# EAGLE board PowerBoard (EAGLE 6.4)
REVISION: C; TITLE: Yellowstone
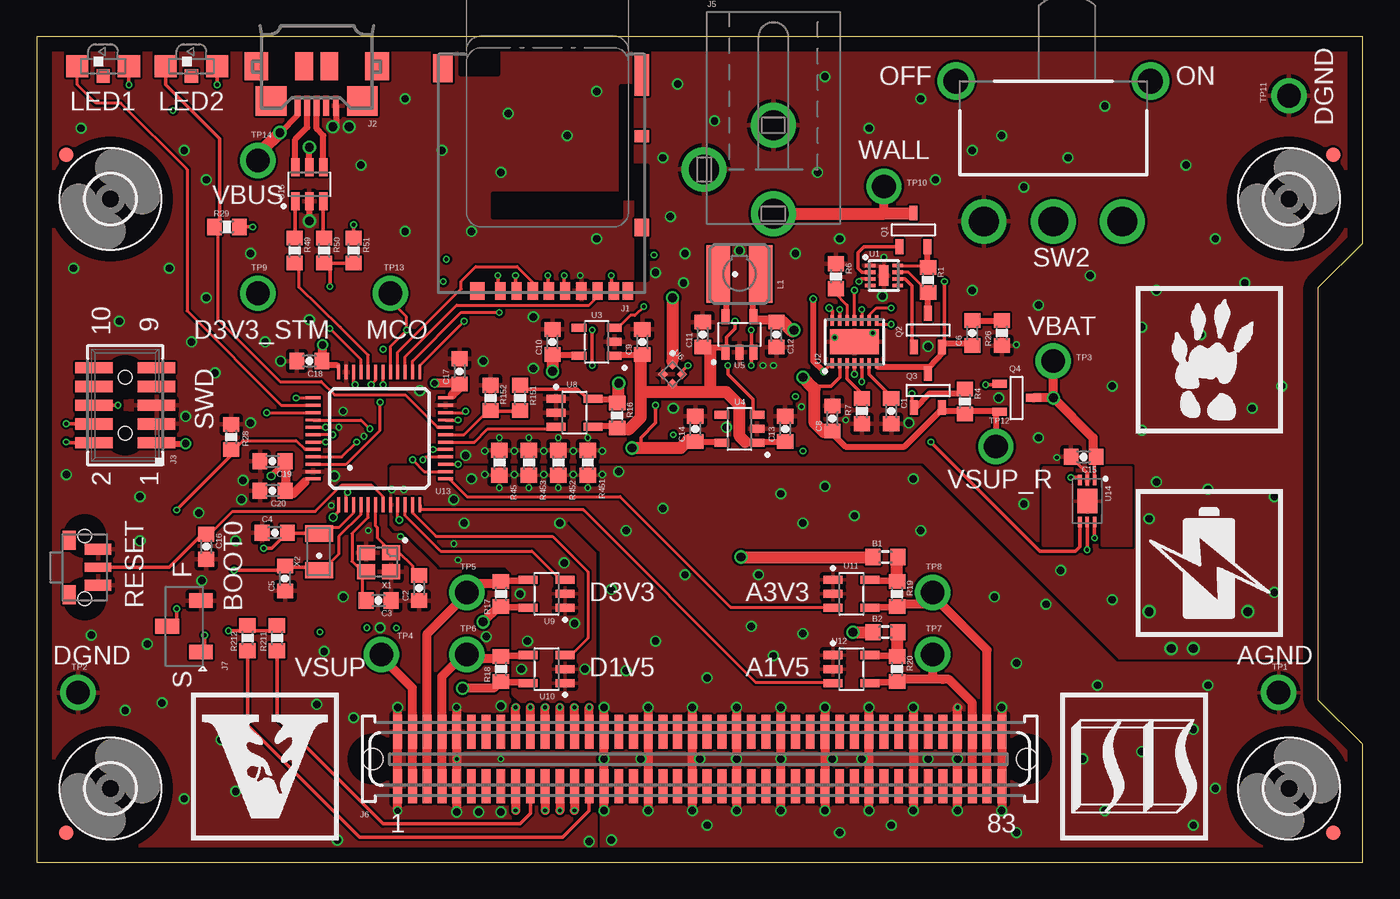
[diagram p5: board, top side]
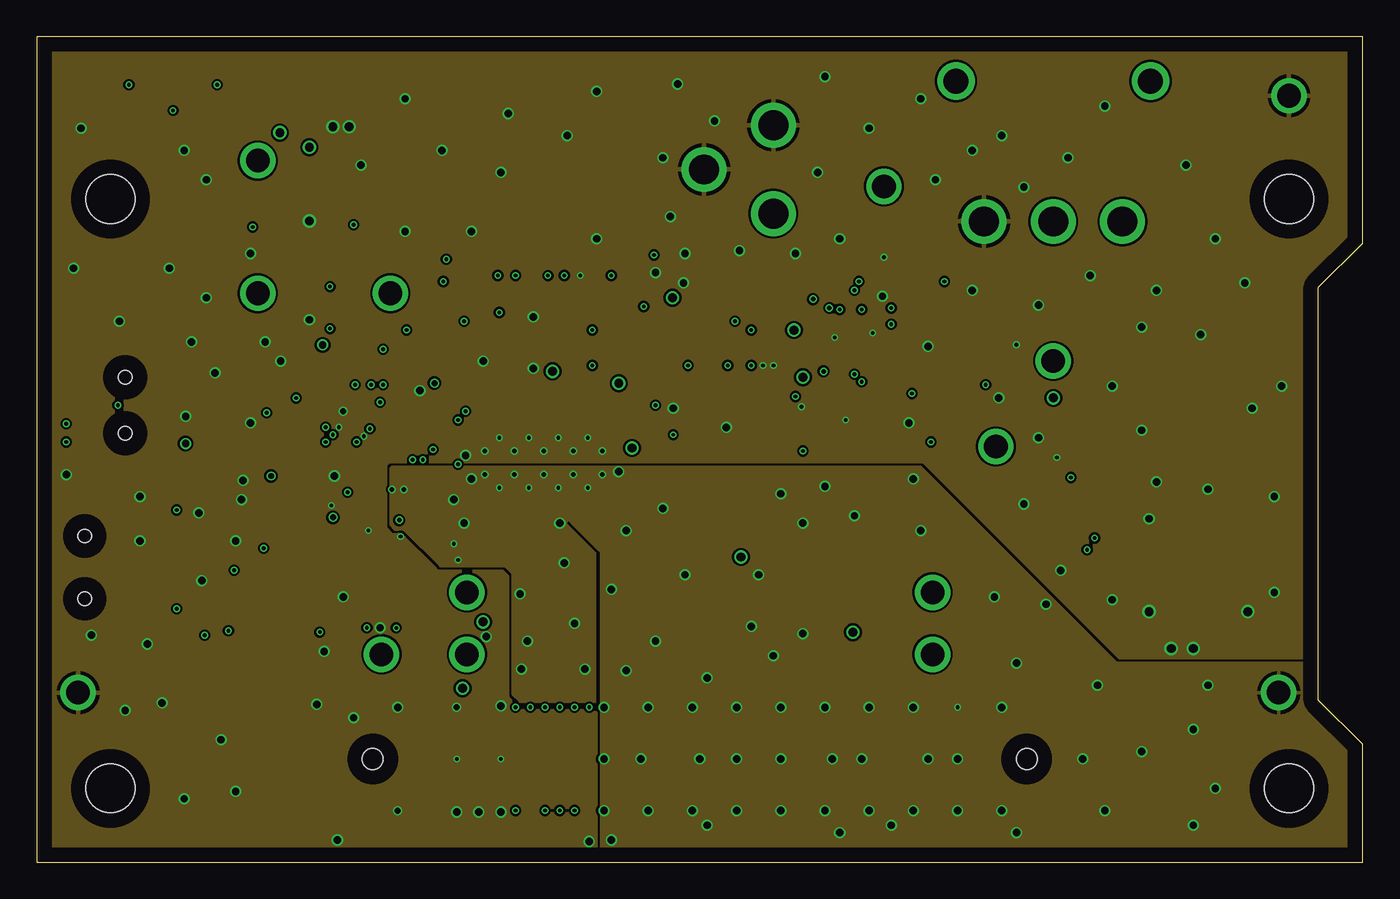
[diagram p6: board, inner layer GND]
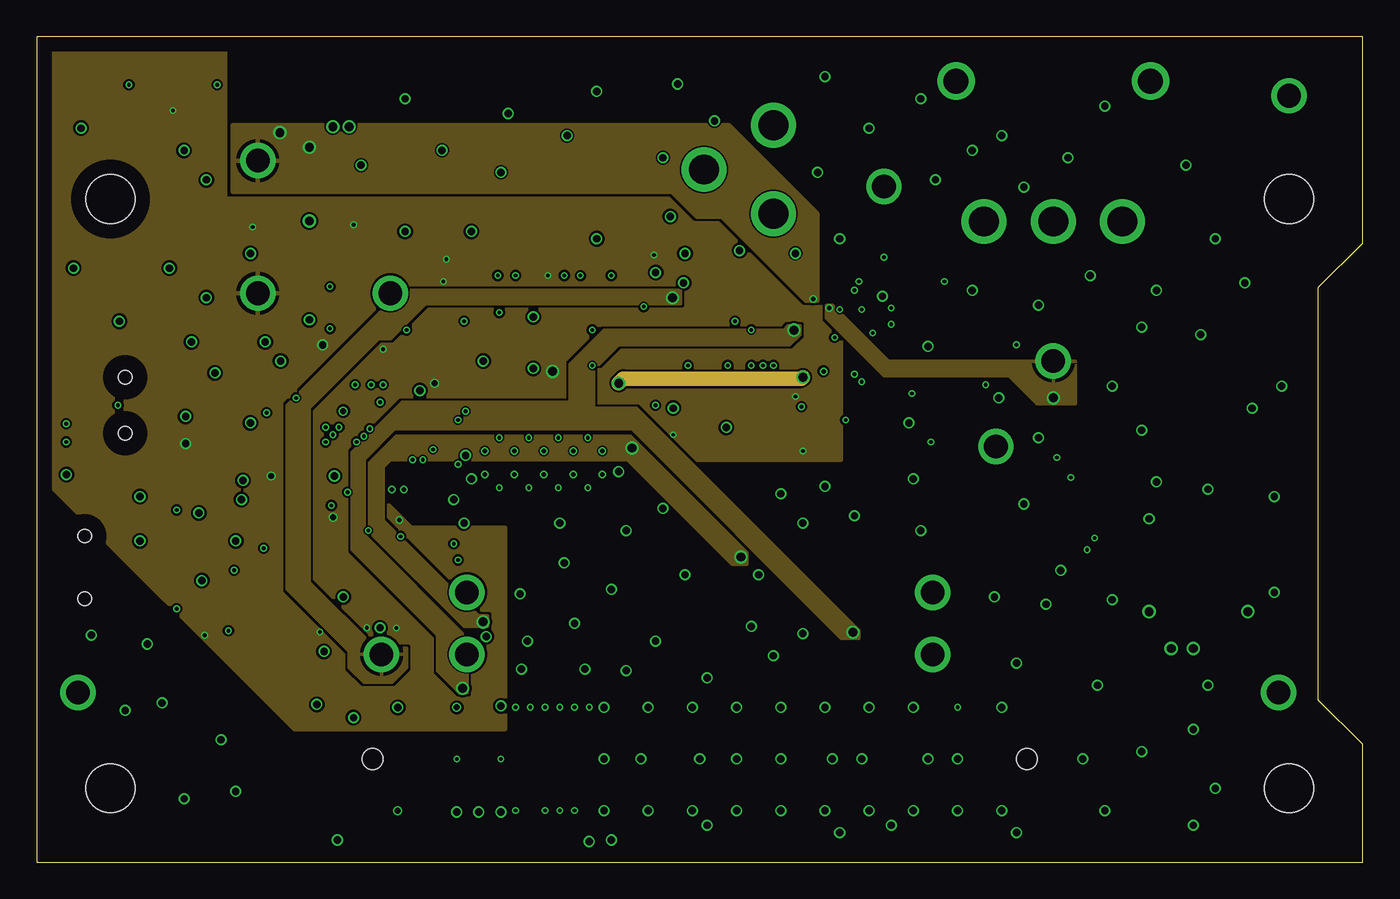
[diagram p7: board, inner layer SUPPLY]
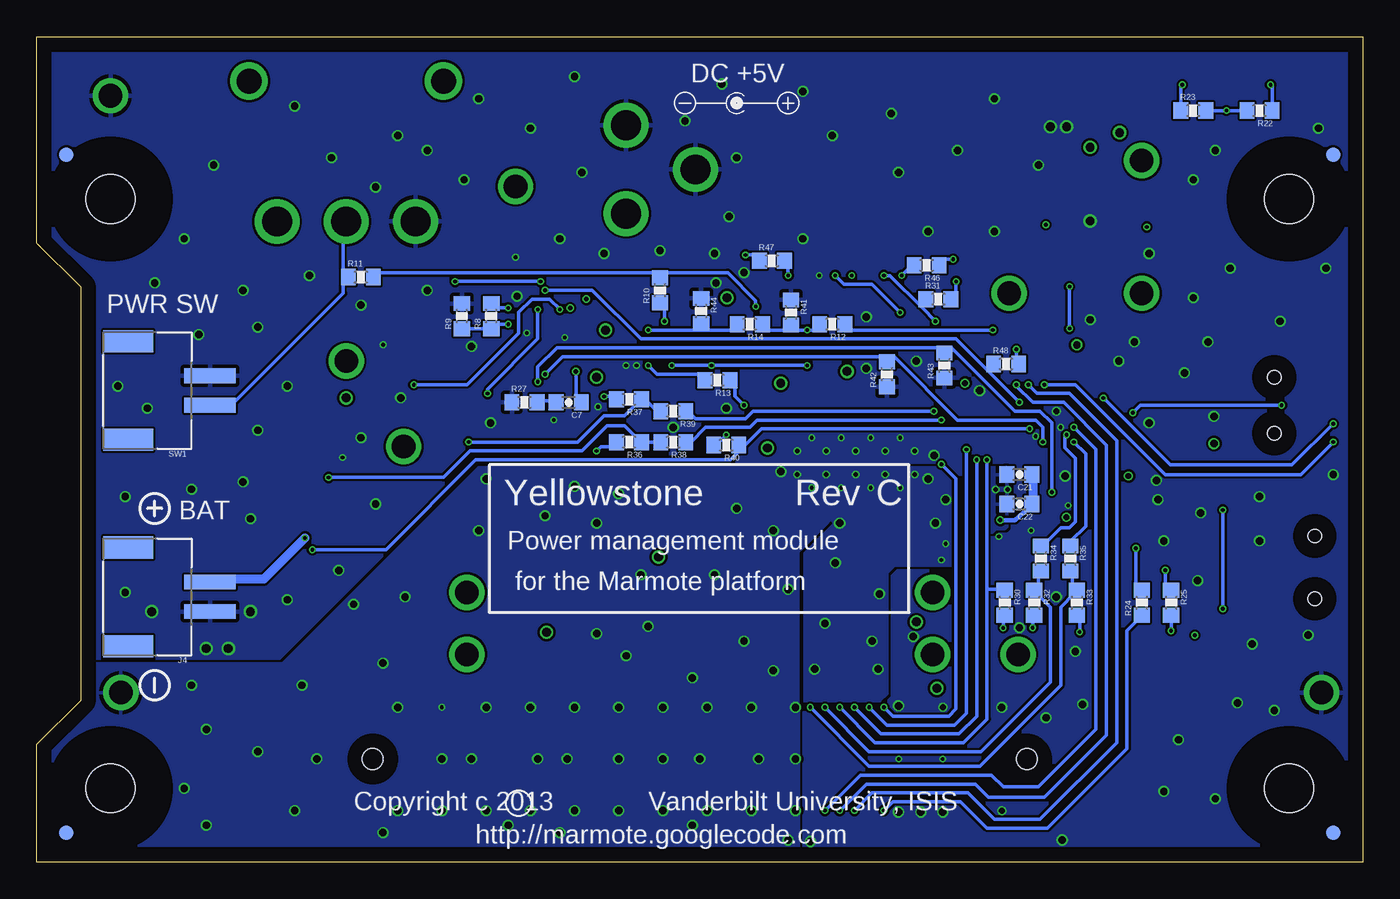
[diagram p8: board, bottom side, seen from below]

Size 90 x 56 mm. Coordinates in mm from the lower left corner, seen from the top.
Outline: 0,56 0,0 90,0 90,8 87,11 87,39 90,42 90,56 0,56
Copper layers (1*2+3*16): Top 0.0356mm / dielectric 5mil / GND 0.0356mm / dielectric 5mil / SUPPLY 0.0356mm / dielectric 40mil / Bottom 0.0356mm
Design rules "default": minimum track width 4mil, minimum drill 8mil, track to track 4mil, track to pad 4mil, pad to pad 4mil, via to via 4mil, smd to smd 4mil, copper to edge 40mil, drill to drill 8mil, minimum pad ring 10mil, minimum via ring 4mil, stop-mask expansion 2mil, vias tented up to drill 0.5mm, thermal gap 10mil
bKeepout: area 15,43.5 to 65,53.5; area 15,6 to 65,16

## Footprints (pad centres in the part's own frame; a part is rotated, then mirrored left to right if it is on the bottom)
L0603 = smd 1 x 1.1: 1 -0.85,0; 2 0.85,0
C0603 = smd 1 x 1.1: 1 -0.85,0; 2 0.85,0
HRS-DM3AT = smd 0.7 x 1.2: 1 2.54,9.49; 2 1.44,9.49; 3 0.34,9.49; 4 -0.76,9.49; 5 -1.86,9.49; 6 -2.96,9.49; 7 -4.06,9.49; 8 -5.16,9.49; B -6.11,9.49 | smd 1 x 0.8: A -7.06,-1.01 | smd 1 x 1.2: MNT@1 -7.06,5.19; MNT@4 4.09,9.49 | smd 1 x 2.8: MNT@2 -7.06,-5.16 | smd 1.3 x 1.9: MNT@3 6.44,-5.61
ZX62R-B-5P = smd 0.4 x 1.35: 1 1.3,2.675; 2 0.65,2.675; 3 0,2.675; 4 -0.65,2.675; 5 -1.3,2.675 | smd 2.1 x 2: MNT$1 -3.1,2.35; MNT$2 3.1,2.35 | smd 1.6 x 1.9: MNT$3 -4.1,0; MNT$4 4.1,0 | smd 1.2 x 1.9: MNT$5 -0.85,0; MNT$6 0.85,0
FTSH-105-01-L-DV-K = smd 2.54 x 0.762: 1 -2.121,2.54; 2 2.121,2.54; 3 -2.121,1.27; 4 2.121,1.27; 5 -2.121,0; 6 2.121,0; 7 -2.121,-1.27; 8 2.121,-1.27; 9 -2.121,-2.54; 10 2.121,-2.54 | hole 0.94: 0,1.905; 0,-1.905
S2B-PH-SM4-TB = smd 1 x 3.5: 1 1,-2.75; 2 -1,-2.75 | smd 1.5 x 3.4: MNT$1 3.35,2.8; MNT$2 -3.35,2.8
PJ-102A = drill 2.032 pad 2.54: 1 0,-3; 2 0,3; 3 -4.7,0
71741-0002 = smd 0.6 x 2.3: 1 -20.5,-1.85; 2 -20.5,1.85; 3 -19.5,-1.85; 4 -19.5,1.85; 5 -18.5,-1.85; 6 -18.5,1.85; 7 -17.5,-1.85; 8 -17.5,1.85; 9 -16.5,-1.85; 10 -16.5,1.85; 11 -15.5,-1.85; 12 -15.5,1.85; 13 -14.5,-1.85; 14 -14.5,1.85; 15 -13.5,-1.85; 16 -13.5,1.85; 17 -12.5,-1.85; 18 -12.5,1.85; 19 -11.5,-1.85; 20 -11.5,1.85; 21 -10.5,-1.85; 22 -10.5,1.85; 23 -9.5,-1.85; 24 -9.5,1.85; 25 -8.5,-1.85; 26 -8.5,1.85; 27 -7.5,-1.85; 28 -7.5,1.85; 29 -6.5,-1.85; 30 -6.5,1.85; 31 -5.5,-1.85; 32 -5.5,1.85; 33 -4.5,-1.85; 34 -4.5,1.85; 35 -3.5,-1.85; 36 -3.5,1.85; 37 -2.5,-1.85; 38 -2.5,1.85; 39 -1.5,-1.85; 40 -1.5,1.85; 41 -0.5,-1.85; 42 -0.5,1.85; 43 0.5,-1.85; 44 0.5,1.85; 45 1.5,-1.85; 46 1.5,1.85; 47 2.5,-1.85; 48 2.5,1.85; 49 3.5,-1.85; 50 3.5,1.85; 51 4.5,-1.85; 52 4.5,1.85; 53 5.5,-1.85; 54 5.5,1.85; 55 6.5,-1.85; 56 6.5,1.85; 57 7.5,-1.85; 58 7.5,1.85; 59 8.5,-1.85; 60 8.5,1.85; 61 9.5,-1.85; 62 9.5,1.85; 63 10.5,-1.85; 64 10.5,1.85; 65 11.5,-1.85; 66 11.5,1.85; 67 12.5,-1.85; 68 12.5,1.85; 69 13.5,-1.85; 70 13.5,1.85; 71 14.5,-1.85; 72 14.5,1.85; 73 15.5,-1.85; 74 15.5,1.85; 75 16.5,-1.85; 76 16.5,1.85; 77 17.5,-1.85; 78 17.5,1.85; 79 18.5,-1.85; 80 18.5,1.85; 81 19.5,-1.85; 82 19.5,1.85; 83 20.5,-1.85; 84 20.5,1.85 | hole 1.4: -22.2,0; 22.2,0
SWITCH-DIP-CJS = smd 1 x 1.6: 1 -1.75,-1.15; 2 0,1.15; 3 1.75,-1.15
4X4MM = smd 3.9 x 1.6: 1 0,1.45; 2 0,-1.45
LED1208-RA = smd 1.5 x 1.5: 1 -1.75,0; 2 1.75,0 | smd 0.9 x 0.9: 3 0,-0.65
3,3 = hole 3.3: 0,0
FIDUCIAL-1X2 = smd 1 x 1: 1 0,0
SOT23-3L = smd 1 x 0.55: 1 -1.15,0.95; 2 -1.15,-0.95; 3 1.15,0
R0603 = smd 1 x 1.1: 1 -0.85,0; 2 0.85,0
MS12ASX30 = drill 2.032: 1 -4.7,-9.53; 2 0,-9.53; 3 4.7,-9.53 | drill 1.702: MNT$1 -6.6,0; MNT$2 6.6,0
TL3340 = smd 0.75 x 1.8: 1 1.225,2.4; 3 -1.225,2.4 | smd 0.6 x 1.8: 2 0,2.4 | smd 1.3 x 0.9: MNT$1 -1.85,0.45; MNT$2 1.85,0.45 | hole 0.9: 2.125,1.5; -2.125,1.5
TESTPOINT = drill 1.6: 1 0,0
DFN-8 = smd 0.7 x 0.25: 1 -0.925,0.675; 2 -0.925,0.225; 3 -0.925,-0.225; 4 -0.925,-0.675; 5 0.925,-0.675; 6 0.925,-0.225; 7 0.925,0.225; 8 0.925,0.675 | smd 0.64 x 1.37: EXP 0,0
DFN-14 = smd 0.7 x 0.25: 1 -1.45,1.5; 2 -1.45,1; 3 -1.45,0.5; 4 -1.45,0; 5 -1.45,-0.5; 6 -1.45,-1; 7 -1.45,-1.5; 8 1.45,-1.5; 9 1.45,-1; 10 1.45,-0.5; 11 1.45,0; 12 1.45,0.5; 13 1.45,1; 14 1.45,1.5 | smd 1.7 x 3.3: EXP 0,0
SOT25 = smd 0.55 x 1: 1 -0.95,-1.2; 2 0,-1.2; 3 0.95,-1.2; 4 0.95,1.2; 5 -0.95,1.2
MLF-4 = smd 0.49 x 0.49: 1 -0.455,0.455; 2 -0.455,-0.455; 3 0.455,-0.455; 4 0.455,0.455
SOT23-5L = smd 1.3 x 0.55: 1 -1.25,0.95; 2 -1.25,0; 3 -1.25,-0.95; 4 1.25,-0.95; 5 1.25,0.95
TQFP-48 = smd 0.2 x 1: 1 -2.75,-4.5; 2 -2.25,-4.5; 3 -1.75,-4.5; 4 -1.25,-4.5; 5 -0.75,-4.5; 6 -0.25,-4.5; 7 0.25,-4.5; 8 0.75,-4.5; 9 1.25,-4.5; 10 1.75,-4.5; 11 2.25,-4.5; 12 2.75,-4.5; 25 2.75,4.5; 26 2.25,4.5; 27 1.75,4.5; 28 1.25,4.5; 29 0.75,4.5; 30 0.25,4.5; 31 -0.25,4.5; 32 -0.75,4.5; 33 -1.25,4.5; 34 -1.75,4.5; 35 -2.25,4.5; 36 -2.75,4.5 | smd 1 x 0.2: 13 4.5,-2.75; 14 4.5,-2.25; 15 4.5,-1.75; 16 4.5,-1.25; 17 4.5,-0.75; 18 4.5,-0.25; 19 4.5,0.25; 20 4.5,0.75; 21 4.5,1.25; 22 4.5,1.75; 23 4.5,2.25; 24 4.5,2.75; 37 -4.5,2.75; 38 -4.5,2.25; 39 -4.5,1.75; 40 -4.5,1.25; 41 -4.5,0.75; 42 -4.5,0.25; 43 -4.5,-0.25; 44 -4.5,-0.75; 45 -4.5,-1.25; 46 -4.5,-1.75; 47 -4.5,-2.25; 48 -4.5,-2.75
DFN-6 = smd 0.7 x 0.25: 1 -1.425,0.5; 2 -1.425,0; 3 -1.425,-0.5; 4 1.425,-0.5; 5 1.425,0; 6 1.425,0.5 | smd 1.65 x 1.35: EXP 0,0
SOT23-6L = smd 1.2 x 0.6: 1 -1.15,0.95; 2 -1.15,0; 3 -1.15,-0.95; 4 1.15,-0.95; 5 1.15,0; 6 1.15,0.95
ECX-2236 = smd 1.2 x 1: 1 -0.85,-0.65; 2 0.85,-0.65; 3 0.85,0.65; 4 -0.85,0.65
ECX-31B = smd 1.1 x 1.9: 1 -1.25,0; 2 1.25,0

## Placement (x,y rotation side)
B1  20m  [L0603]  57.6,20.7 0 top
B2  20m  [L0603]  57.6,15.6 0 top
C1  0.15uF  [C0603]  58,30.6 270 top
C2  10pF  [C0603]  25.95,18.6 90 top
C3  10pF  [C0603]  23.2,17.75 180 top
C4  4pF  [C0603]  16.15,22.35 0 top
C5  4pF  [C0603]  16.85,19.25 90 top
C6  10uF  [C0603]  63.5,35.9 90 top
C7  4.7uF  [C0603]  53.9,31.2 180 bottom
C8  4.7uF  [C0603]  54,30.1 90 top
C9  10uF  [C0603]  41.1,35.3 90 top
C10  4.7uF  [C0603]  35,35.3 90 top
C11  4.7uF  [C0603]  45.2,35.8 90 top
C12  10uF  [C0603]  50.2,35.8 270 top
C13  10uF  [C0603]  50.8,29.4 90 top
C14  4.7uF  [C0603]  44.7,29.4 90 top
C15  0.1uF  [C0603]  71.05,27.5 180 top
C16  0.1uF  [C0603]  11.5,21.4 270 top
C17  0.1uF  [C0603]  28.7,33.3 90 top
C18  0.1uF  [C0603]  18.5,34 180 top
C19  0.1uF  [C0603]  16,27.2 180 top
C20  4.7uF  [C0603]  16,25.2 180 top
C21  1uF  [C0603]  23.3,26.3 180 bottom
C22  10nF  [C0603]  23.3,24.3 180 bottom
J1  CON-HRS-DM3AT  [HRS-DM3AT]  34,48.25 180 top
J2  CON-ZX62R-B-5P  [ZX62R-B-5P]  19,54 180 top
J3  CON-FTSH-105-01-L-DV-K  [FTSH-105-01-L-DV-K]  6,31 180 top
J4  CON-S2B-PH-SM4-TB  [S2B-PH-SM4-TB]  81,18 90 bottom
J5  CON-PJ-102A  [PJ-102A]  50,47 0 top
J6  CON-71741-0002-TOP  [71741-0002]  45,7 0 top
J7  SWITCH-CJS-1200-1200  [SWITCH-DIP-CJS]  10,16 90 top
L1  1.6uH  [4X4MM]  47.7,39.9 90 top
LED1  GREEN  [LED1208-RA]  4.5,54 0 top
LED2  ORANGE  [LED1208-RA]  10.5,54 0 top
LOGO1  LOGO-ISIS-600MIL-10MM-SS  [LOGO-ISIS-10MM-SILKSCREEN]  69.5,1.5 0 top
LOGO2  LOGO-BATTERY-600MIL-10MM-SS  [LOGO-BATTERY-10MM-SILKSCREEN]  74.6,15.3 0 top
LOGO5  LOGO-VANDERBILT-600MIL-10MM-SS  [LOGO-VANDERBILT-10MM-SILKSCREEN]  10.5,1.5 0 top
LOGO6  LOGO-MARMOTE-600MIL-10MM-SS  [LOGO-MARMOTE-10MM-SILKSCREEN]  74.6,29.1 0 top
M1  MOUNT-HOLE3.3  [3,3]  5,5 0 top
M2  MOUNT-HOLE3.3  [3,3]  5,45 0 top
M3  MOUNT-HOLE3.3  [3,3]  85,45 0 top
M4  MOUNT-HOLE3.3  [3,3]  85,5 0 top
M5  FIDUCIAL1X2  [FIDUCIAL-1X2]  2,2 0 top
M6  FIDUCIAL1X2  [FIDUCIAL-1X2]  2,48 0 top
M7  FIDUCIAL1X2  [FIDUCIAL-1X2]  88,48 0 top
M8  FIDUCIAL1X2  [FIDUCIAL-1X2]  88,2 0 top
M9  FIDUCIAL1X2  [FIDUCIAL-1X2]  2,48 0 bottom
M10  FIDUCIAL1X2  [FIDUCIAL-1X2]  88,48 0 bottom
M11  FIDUCIAL1X2  [FIDUCIAL-1X2]  2,2 0 bottom
M12  FIDUCIAL1X2  [FIDUCIAL-1X2]  88,2 0 bottom
Q1  SI2323CDS  [SOT23-3L]  59.5,42.9 90 top
Q2  SI2312CDS  [SOT23-3L]  60.5,36.1 90 top
Q3  SI2333CDS  [SOT23-3L]  60.5,32 90 top
Q4  SI2333CDS  [SOT23-3L]  66.5,31.5 0 top
R1  0  [R0603]  60.5,39.5 270 top
R4  10k  [R0603]  63,31.25 270 top
R6  100k  [R0603]  54.25,39.75 270 top
R7  2.1k  [R0603]  56,30.6 90 top
R8  10k  [R0603]  59.15,37.05 90 bottom
R9  10k  [R0603]  61.15,37.05 90 bottom
R10  100k  [R0603]  47.7,38.8 90 bottom
R11  4.7k  [R0603]  68,39.7 0 bottom
R12  0  [R0603]  36,36.5 180 bottom
R13  DNP  [R0603]  43.8,32.7 180 bottom
R14  0  [R0603]  41.6,36.5 180 bottom
R16  50m  [R0603]  39.4,30.3 270 top
R17  50m  [R0603]  31.5,18.2 90 top
R18  50m  [R0603]  31.5,13.1 90 top
R19  50m  [R0603]  58.4,18.2 270 top
R20  50m  [R0603]  58.4,13.1 270 top
R22  100  [R0603]  7,51 180 bottom
R23  330  [R0603]  11.5,51 0 bottom
R24  0  [R0603]  15,17.6 90 bottom
R25  0  [R0603]  13,17.6 270 bottom
R26  1  [R0603]  65.5,35.9 90 top
R27  1  [R0603]  56.9,31.2 0 bottom
R28  100k  [R0603]  13.2,28.85 270 top
R29  4.7k  [R0603]  12.9,43.1 0 top
R30  100k  [R0603]  24.3,17.6 270 bottom
R31  100k  [R0603]  28.8,38.2 0 bottom
R32  4.7k  [R0603]  22.3,17.6 270 bottom
R33  4.7k  [R0603]  19.4,17.6 270 bottom
R34  100  [R0603]  21.85,20.6 270 bottom
R35  100  [R0603]  19.85,20.6 270 bottom
R36  4.7k  [R0603]  49.8,28.5 180 bottom
R37  4.7k  [R0603]  49.8,31.4 180 bottom
R38  100  [R0603]  46.8,28.5 180 bottom
R39  100  [R0603]  46.8,30.6 180 bottom
R40  100k  [R0603]  43.2,28.3 180 bottom
R41  100k  [R0603]  38.8,37.3 270 bottom
R42  DNP  [R0603]  32.3,33.1 90 bottom
R43  DNP  [R0603]  28.4,33.7 90 bottom
R44  DNP  [R0603]  44.9,37.4 270 bottom
R45  0  [R0603]  31.4,27.1 270 top
R46  100k  [R0603]  29.6,40.5 180 bottom
R47  100k  [R0603]  40.1,40.8 0 bottom
R48  10k  [R0603]  24.2,33.8 0 bottom
R49  22  [R0603]  17.5,41.5 270 top
R50  22  [R0603]  19.5,41.5 270 top
R51  1.5k  [R0603]  21.5,41.5 90 top
R151  100k  [R0603]  32.8,31.5 90 top
R152  100k  [R0603]  30.8,31.5 270 top
R211  0  [R0603]  16.3,15.2 90 top
R212  DNP  [R0603]  14.3,15.2 90 top
R451  0  [R0603]  37.4,27.1 270 top
R452  0  [R0603]  35.4,27.1 270 top
R453  0  [R0603]  33.4,27.1 270 top
SW1  SWITCH-SPST  [S2B-PH-SM4-TB]  81,32 90 bottom
SW2  SWITCH-MS12ASG30  [MS12ASX30]  69,53 0 top
SW3  SWITCH-ESWITCH-TL3340G  [TL3340]  1.75,20 270 top
TP1  TESTPOINT  [TESTPOINT]  84.3,11.5 0 top
TP2  TESTPOINT  [TESTPOINT]  2.8,11.5 0 top
TP3  TESTPOINT  [TESTPOINT]  69,34 0 top
TP4  TESTPOINT  [TESTPOINT]  23.4,14.1 0 top
TP5  TESTPOINT  [TESTPOINT]  29.2,18.3 0 top
TP6  TESTPOINT  [TESTPOINT]  29.2,14.1 0 top
TP7  TESTPOINT  [TESTPOINT]  60.8,14.1 0 top
TP8  TESTPOINT  [TESTPOINT]  60.8,18.3 0 top
TP9  TESTPOINT  [TESTPOINT]  15,38.6 0 top
TP10  TESTPOINT  [TESTPOINT]  57.5,45.85 0 top
TP11  TESTPOINT  [TESTPOINT]  85,52 90 top
TP12  TESTPOINT  [TESTPOINT]  65.1,28.2 0 top
TP13  TESTPOINT  [TESTPOINT]  24,38.6 0 top
TP14  TESTPOINT  [TESTPOINT]  15,47.6 0 top
U1  LTC4361-2DC  [DFN-8]  57.5,39.8 0 top
U2  LTC4085  [DFN-14]  55.5,35.3 90 top
U3  XC6220B331MR-G  [SOT25]  38,35.3 90 top
U4  XC6220B331MR-G  [SOT25]  47.7,29.4 90 top
U5  XC9236A15DMR-G  [SOT25]  47.7,35.8 0 top
U6  MIC94043  [MLF-4]  43.15,33.1 315 top
U8  MAX9938FEUK  [SOT23-5L]  36.5,30.5 0 top
U9  MAX9938FEUK  [SOT23-5L]  34.6,18.2 180 top
U10  MAX9938FEUK  [SOT23-5L]  34.6,13.1 180 top
U11  MAX9938FEUK  [SOT23-5L]  55.3,18.2 0 top
U12  MAX9938FEUK  [SOT23-5L]  55.3,13.1 0 top
U13  STM32F10XCXT6  [TQFP-48]  23.25,28.75 0 top
U14  LTC2942-1  [DFN-6]  71.3,24.5 270 top
U15  USBLC6-2  [SOT23-6L]  18.5,46 90 top
X1  ECX-2236  [ECX-2236]  23.2,20.35 180 top
X2  ECX-31B  [ECX-31B]  19.15,21.05 90 top

## Tracks (layer width: path | path; a pad name or v marks a point on that pad's centre or on a via)
!ACPR  (via drill 0.25)
  Top 0.203: v56,37.5 U2.10 | 59.4,30.5 59.55,30.65 Q3.1 59.6,30.8 | 62.9,31.8 62.9,32.1 R4.1
  Top 0.254: v59.4,31.8 59.4,30.5
  Top 0.406: 59.6,30.8 60.6,31.8 62.9,31.8
  Bottom 0.254: v59.4,31.8 59.4,32.1 56,35.5 v56,37.5
A1V5
  Top 0.203: 56.9,12.2 56.9,12.15 U12.4 | 58,12.2 58,12.25 R20.2 58.7,12.25 58.7,12.4 | 60.8,12.5 60.8,12.4 61.5,12.4 | 60.8,13.1 TP7.1
  Top 0.457: 58,12.2 56.9,12.2
  Top 0.61: 58.7,12.4 61.5,12.4 61.9,12.4 63.5,10.8 63.5,10.5 J6.80 J6.79 | 60.8,13.1 60.8,12.5
A1V5_I
  Top 0.203: 58.4,14 R20.1 | 58.4,15.1 58.4,15.6 B2.2 | 58.4,14.1 58.4,14 | 58.4,14 58.5,14 | 56.6,14 56.6,14.05 U12.5
  Top 0.457: 56.6,14 58.5,14 58.6,14
  Top 0.813: 58.4,15.1 58.4,14.1
A1V5_SENSE
  Top 0.203: U13.12 26,23.9 37.1,23.9 48.8,12.2 53.5,12.2 53.5,12.15 U12.3
A3V3
  Top 0.203: 58.3,17.3 58.3,17.35 R19.2 58.8,17.35 58.8,17.5 | 57.1,17.3 57.1,17.25 U11.4 | 60.4,17.5 60.4,18.3 TP8.1 60.8,17.6 61.3,17.6
  Top 0.457: 58.3,17.3 57.1,17.3
  Top 0.61: 64.5,5 J6.81 J6.82 64.5,14.4 61.3,17.6 | 60.4,17.5 58.8,17.5
A3V3_I
  Top 0.203: R19.1 58.4,19.1 58,19.1 | 58.4,20.8 58.4,20.7 B1.2 | 56.7,19.1 56.7,19.15 U11.5
  Top 0.457: 58.2,19.1 58,19.1 56.7,19.1
  Top 0.813: 58.4,19.1 58.4,20.8
A3V3_SENSE
  Top 0.203: U11.3 53.6,17.25 53.6,17.3 47.1,17.3 39.6,24.8 29.2,24.8 28,26 U13.13
AGND  (via drill 0.25, 0.3, 0.5)
  Top 0.61: v38.5,3.5 v38.5,10.5 | v41.5,10.5 v41.5,3.5 | v44.5,3.5 v44.5,10.5 | v47.5,10.5 v47.5,3.5 | v50.5,3.5 v50.5,10.5 | v53.5,10.5 v53.5,3.5 | v56.5,3.5 v56.5,10.5 | v59.5,10.5 v59.5,3.5 | v62.5,3.5 v62.5,10.5 | v65.5,10.5 v65.5,3.5
  other vias: 62.5,7 32.4,26.3 31.4,25.4 30.4,26.3 60.5,7 56,7 54,7 50.5,7 47.5,7 45,7 41,7 38.5,7 33.4,25.4 34.4,26.3 35.4,25.4 36.4,26.3 37.4,25.4 38.4,26.3 42,15 40,13 50,14 44,19.5 49,19.5 55.5,23.5 60,22.5 65,18 68.5,17.5 66.5,13.5 72,12 75,7.5 71,7 66.5,2 58,2.5 54.5,2 45.5,2.5 39,1.5 50.5,25 59.5,26 35.5,23 39,18.5 29.5,26 39.5,26.5 42.5,24 28.3,24.6 24.9,25.3 24.1,25.3 40,22.5 52,15.5 48.5,16 45.5,12.5 52,23 53.5,25.5 28.3,21.6 28.6,20.5 35.8,20.3 32.8,18.2 36.5,16.2 33.3,15 32.9,13.1 37.2,13.1 78.5,2.5 78.5,9 79.5,12 72.5,3.5 80,5 29,23
  pour Top (isolate 0.152): 90,0 90,13.5 73.3,13.5 60,26.8 24.1,26.8 24,26.7 24,22.9 24.3,22.6 24.9,22.6 27.4,20.1 31.8,20.1 32.3,19.6 32.3,11.4 32.8,10.9 38,10.9 38.3,10.6 38.3,0
  pour Bottom (isolate 0.152): 90,13.5 73.3,13.5 60,26.8 24.2,26.8 24,26.6 24,22.9 24.3,22.6 24.9,22.6 27.4,20.1 31.8,20.1 32.3,19.6 32.3,11.4 32.8,10.9 38,10.9 38.3,10.6 38.3,0 90,0
  pour GND (isolate 0.152): 90,0 90,13.5 73.3,13.5 60,26.8 24.1,26.8 24,26.7 24,22.9 24.3,22.6 24.9,22.6 27.4,20.1 31.8,20.1 32.3,19.6 32.3,11.4 32.8,10.9 38,10.9 38.3,10.6 38.3,0
BOOT0  (via drill 0.25)
  Top 0.203: U13.44 18.2,28 17.6,28.6 14,28.6 13.6,28.2 13.6,28 13.5,28 | R28.2 13.2,27.7 13.3,27.7 | 9.5,16.15 J7.2
  Top 0.254: 13.6,28 13.3,27.7 v9.5,23.9 | v9.5,17.2 9.5,16.15
  Bottom 0.254: v9.5,23.9 v9.5,17.2
CLPROG
  Top 0.203: R7.2 55.9,31.55 55.9,31.9
  Top 0.254: U2.3 55,32.8 55.9,31.9
D1V5
  Top 0.203: 28.9,14 29,14.1 TP6.1 29.5,13.8 29.9,13.8 | 31.9,14 31.85,13.95 R18.2 31.4,13.95 31.4,13.8 | 32.8,14 32.85,14.05 U10.4
  Top 0.457: 32.8,14 31.9,14
  Top 0.61: 28.9,14 27.5,12.6 J6.8 J6.7 | 31.4,13.8 29.9,13.8
D1V5-EN  (via drill 0.25)
  Top 0.203: 48.5,34.2 48.65,34.35 U5.3 48.65,34.95 48.5,35.1
  Top 0.254: v48.5,36.1 48.5,35.1 | v48.5,33.7 48.5,34.2
  Bottom 0.203: R14.2 42.8,36.15 42.8,36.1 | R44.2 45,36.45 45,36.1 | R13.2 44.7,32.75 44.7,33.1
  Bottom 0.254: 44.7,33.1 47.9,33.1 v48.5,33.7 | 42.8,36.1 45,36.1 v48.5,36.1
D1V5_I  (via drill 0.6)
  Top 0.203: 32.9,12.2 32.95,12.15 U10.5 | 31.9,12.2 31.85,12.25 R18.1 31.45,12.25 31.3,12.1 | L1.2 49.05,39.8 48.6,39.8 | 51.3,36 v51.4,36.1 | 50,36.8 50.05,36.8 C12.1 50.25,36.7 50.6,36.7 | 56.6,15.6 B2.1 | 48.8,36.8 48.8,37 U5.4 48.6,37 48.6,37.1
  Top 0.406: 48.6,37.1 48.6,39.8
  Top 0.457: 31.9,12.2 32.9,12.2
  Top 0.61: 31.3,12.1 31,11.8 v28.9,11.8 | 48.8,36.8 50,36.8
  Top 0.813: v55.4,15.6 56.6,15.6 | 51.3,36 50.6,36.7
  pour SUPPLY: 51.8,35.8 51.1,35.1 39.5,35.1 37.8,33.4 37.8,30.8 40.7,30.8 55.8,15.7 55.8,15.2 54.6,15.2 40.4,29.4 24.3,29.4 22.2,27.3 22.2,22.2 29.2,15.2 29.2,11.5 28.7,11.5 27.2,13 27.2,15.4 21.4,21.2 21.4,27.8 24.8,31.2 36.2,31.2 36.2,33.8 38.5,36.1 50.7,36.1 51,36.4 51.8,36.4
D1V5_SENSE
  Top 0.203: U13.11 25.5,23.7 27.1,22.1 35,22.1 37.4,19.7 37.4,15.2 36.35,14.15 35.95,14.15 U10.3
D3V3
  Top 0.203: 28.9,17.9 29.2,18.2 TP5.1 29.4,18.3 30,18.9 | 31.8,19.1 31.75,19.05 R17.2 31.35,18.9 31.1,18.9 | U9.4 33.3,19.1 32.9,19.1
  Top 0.457: 32.9,19.1 31.8,19.1
  Top 0.61: 31.1,18.9 30,18.9 | J6.5 J6.6 26.5,15.5 28.9,17.9
D3V3_I  (via drill 0.25, 0.6)
  Top 0.203: 32.9,17.3 32.95,17.25 U9.5 | 32,17.3 31.95,17.35 R17.1 31.35,17.35 31.3,17.3 | 45,28.5 44.75,28.5 C14.1 44.65,28.6 44.2,28.6 | 41,28.3 40.8,28.1 v40.4,28.1 | 56.5,20.7 B1.1 | 46.2,28.5 46.2,28.45 U4.5
  Top 0.254: 41,28.3 41,28.8 42,29.8 v42,31
  Top 0.406: 46.2,28.5 45,28.5 44.9,28.5
  Top 0.457: 32,17.3 32.9,17.3
  Top 0.61: 31.3,17.3 v30.3,16.3
  Top 0.813: v47.8,20.7 56.5,20.7 | v40.4,28.1 43.7,28.1 44.2,28.6
  Bottom 0.203: R13.1 42.6,32.35 42.6,32.3
  Bottom 0.254: v42,31 42.6,31.6 42.6,32.3
  pour SUPPLY: 48.2,20.2 48.2,21 40.3,28.9 24.4,28.9 22.6,27.1 22.6,22.4 29,16 30.6,16 30.6,16.7 30,16.7 23.5,23.2 23.5,26.8 24,27.3 40.1,27.3 47.2,20.2
D3V3_SENSE
  Top 0.203: U13.10 25,23.5 27.4,21.1 33.6,21.1 35.45,19.25 35.45,19.15 U9.3
D3V3_STM  (via drill 0.23, 0.25, 0.3, 0.41, 0.5, 0.6)
  Top 0.203: v24.6,23.2 24.5,23.3 U13.9 | 9.1,28.4 8.12,28.4 J3.1 | 11.4,14.35 11.75,14.35 J7.1 | 16.9,26.8 16.85,26.8 | 16.85,26.8 C19.1 | 16.9,25.5 16.85,25.5 C20.1 16.85,25 17.4,25 | 16.85,26.8 16.5,26.8 | 18.2,25.8 18.4,26 U13.48 | 28.2,31.7 28,31.5 U13.24 | 28.6,32.1 28.7,32.2 C17.1 28.65,32.5 28.3,32.5 | 35,34.1 C10.1 35.05,34.4 35.3,34.4 | 34.7,39 34.76,38.94 J1.4 | 19.6,33.7 19.35,33.95 C18.1 19.35,34.35 19.4,34.4 | 20.4,33.7 20.5,33.6 U13.36 | U13.1 20.5,23.8 | 36.7,34.4 36.7,34.35 U3.5
  Top 0.254: v20.1,23.4 20.5,23.8 | 34.7,39 v34.7,39.8 | R29.2 v14.65,43.1 | R51.2 v21.5,43.25 | 11.4,14.35 v11.4,15.4
  Top 0.406: 9.1,28.4 v10.1,28.4 | 36.7,34.4 35.3,34.4 | 20.4,33.7 19.6,33.7 | v15.9,26.2 16.5,26.8
  Top 0.61: 28.6,32.1 28.2,31.7 | 28.3,32.5 v27,32.5 | 19.4,34.4 v19.4,35.1 | 17.4,25 18.2,25.8 | 16.9,26.8 16.9,25.5
  Top 0.813: 35,34.1 v35,33.3
  Bottom 0.203: 19.2,16.3 19.4,16.5 R33.2 | 50.9,28.2 50.65,28.45 R36.2 | R40.2 43.85,28.5 43.7,28.5 | R47.1 41.3,41.15 41.3,41.2 | 28.4,40.9 28.75,40.55 R46.1 | 27.6,38.7 27.95,38.35 R31.2 | 23.5,34 23.35,33.85 R48.2 | 22.4,16.6 22.3,16.7 R32.2 | R37.2 50.6,31.45 50.6,31.6 | 22.4,26 22.4,26.3 C21.1 | R30.2 24.3,16.5 24.4,16.5 | 22.4,24.3 C22.1
  Bottom 0.254: 50.6,31.6 v51.5,31.6 | v24.4,15.9 24.4,16.5 24.4,16.8 | 22.4,16.6 v22.4,15.9 | 50.9,28.2 51.7,28.2 v52,27.9 | 41.3,41.2 v41.9,41.2 | R22.2 v9.25,51 R23.2 | v27.8,40.9 28.4,40.9 | 43.7,28.5 v43.2,29 | 19.2,16.3 v19.2,15.6 | v27.6,39.4 27.6,38.7 | 23.5,34 v23.5,34.8
  Bottom 0.305: 22.4,24.3 23.6,23.2 v24.6,23.2
  Bottom 0.61: 22.4,26 22.4,24.3
  pour SUPPLY (isolate 0.152, rank 2): 0,56 12.8,56 12.8,45 54.6,45 54.6,27.3 24,27.3 23.5,26.8 23.5,24.6 25.4,22.7 31.8,22.7 31.8,9 17.5,9 0,26.5
D3V3_STM-EN  (via drill 0.25)
  Top 0.203: v41.2,37.7 40.6,37.1 40.3,37.1 39.4,36.2 39.2,36.2 U3.3
  Bottom 0.203: R10.2 47.5,39.85 47.5,40 | 66.9,40 66.9,39.95 R11.2
  Bottom 0.254: 66.9,40 47.5,40 43.1,40 41.2,38.1 v41.2,37.7
D3V3_STM-EN-SW
  Bottom 0.203: 76.9,30.9 77,31 SW1.2 | 69.2,38.6 69.2,39.35 R11.1 | 69,43.5 SW2.2
  Bottom 0.254: 76.9,30.9 69.2,38.6 69.2,43.3 69,43.5
DGND  (via drill 0.23, 0.25, 0.3, 0.41, 0.5, 0.6)
  Top 0.203: U1.1 56.75,40.48
  Top 0.254: U1.EXP 57.5,40.48 | 69.95,27.25 C15.2 71.3,26.4 U14.2
  Top 0.406: U15.2 v18.5,43.5 | J2.5 20.3,49.8
  Top 0.61: v28.5,10.5 v28.5,3.4 | v24.5,3.5 v24.5,10.5
  other vias: 20.1,49.9 10.1,30.25 31.5,7 36.9,39.8 57.5,41.05 54.15,35.6 56.75,35.9 69.25,27.45 16.55,34 30.4,27.9 31.4,28.8 32.4,27.9 75.5,17 66.5,35.1 28.5,7 31.5,10.6 31.5,3.4 33.4,28.8 34.4,27.9 35.4,28.8 37.4,28.8 36.4,27.9 38.4,27.9 77,14.5 78.5,14.5 82.2,17 21.2,49.9 20.8,30.6 22.2,28.9 20.5,29.5 22.5,22.5 30.5,15.3 20.8,18 19.5,14.3 19,10.7 21.5,9.8 8.5,10.8 7.5,14.8 12.5,8.3 13.5,4.8 10,4.3 37.5,1.4 11.2,19.1 13.5,21.8 14,25.9 11,23.7 13.9,24.6 14.5,29.8 12.1,33.2 7,24.8 2,26.3 7,21.8 3.7,15.4 6,10.3 10.5,35.3 9,40.3 2.5,40.3 11.5,38.3 11.5,46.3 10,48.3 3,49.8 14.5,41.3 22,47.3 25,51.8 27.5,48.3 25,42.8 32,50.8 38,52.3 36,49.3 31.5,46.8 38,42.3 29.5,42.8 43.5,52.8 46,50.3 53,46.8 53.5,53.3 56.5,49.8 60,51.8 61,46.3 54.5,42.3 51.5,41.3 43,43.8 44,41.3 42.5,47.8 47.7,41.5 65.5,49.3 67,45.8 63.5,48.3 72.5,51.3 70,47.8 78,47.3 80,42.3 76,38.8 82,39.3 75,36.3 71.5,39.8 84.5,32.3 79,35.8 82.5,30.8 79.5,25.3 84,24.8 84,18.3 73,17.8 69.5,19.8 67,24.3 68,28.8 75,29.3 76,25.8 75.5,23.3 73,32.3 68,37.8 63.5,38.8 23.3,15.9 29.1,27.6 43.2,30.8 59.2,29.8 54.9,30 65.3,31.5 60.5,35 57.4,38.4 20.4,1.5 30,3.4 20.2,26.2 46.8,29.5 42,40 33.7,37 30.3,34 33.7,33.5 5.6,36.7 43.9,39.3 26,32 49.3,33.7 50,33.7 51.9,30.9 20,24.2 18.5,36.8 15.5,35.3 24.7,22.1
  pour GND (isolate 0.152, rank 2): 0,0 0,56 90,56 90,0
  pour Bottom (isolate 0.152, rank 2): 0,56 0,0 90,0 90,56
  pour Top (isolate 0.152, rank 2): 0,0 0,56 90,56 90,0 77.6,0 37.8,0
EXP
  pour Top (isolate 0.152): 70.3,23.75 72.3,23.75 72.3,21.5 74.3,21.5 74.3,26.75 72.3,26.75 72.3,25.25 70.3,25.25 70.3,26.75 68.3,26.75 68.3,21.5 70.3,21.5
GATE1
  Top 0.203: 59.4,35.35 59.4,34.95 Q2.1
  Top 0.254: U1.6 58.92,39.58 59.4,39.1 59.4,35.35
GATE2  (via drill 0.25)
  Top 0.203: Q4.1 65.3,32.4 65,32.4
  Top 0.254: U2.13 v54.5,37.5 | v64.4,32.4 65,32.4
  Bottom 0.254: v64.4,32.4 60.8,32.4 57.3,35.9 57.3,37.3 56.4,38.2 55.2,38.2 v54.5,37.5
GATEP
  Top 0.254: U1.2 56.02,40.02 55.75,40.3 55.75,41.35 56.15,41.75 Q1.1
I2C1_SCL  (via drill 0.25)
  Top 0.61: J6.26 v36.5,10.5
  Bottom 0.203: 22.1,18.2 22.3,18.4 R32.1 22.3,18.6 22,18.9
  Bottom 0.254: 22.1,18.2 21.2,17.3 21.2,12.2 25.9,7.5 33.5,7.5 v36.5,10.5 | R34.2 22,19.6 22,18.9
I2C1_SCLI  (via drill 0.25)
  Top 0.203: v20.1,29 U13.42
  Bottom 0.203: 21.45,21.75 21.75,21.45 R34.1
  Bottom 0.254: v20.1,29 20.2,28.9 20.2,28.1 19.5,27.4 19.5,23.1 19.9,22.7 20.5,22.7 21.45,21.75
I2C1_SDA  (via drill 0.25)
  Top 0.61: J6.28 v37.5,10.5
  Bottom 0.203: 19.7,18.9 19.4,18.6 R33.1 19.6,18.25 19.6,18.2
  Bottom 0.254: 19.6,18.2 20.5,17.3 20.5,12 26,6.5 33.5,6.5 v37.5,10.5 | R35.2 19.7,19.6 19.7,18.9
I2C1_SDAI  (via drill 0.25)
  Top 0.203: v19.6,28.5 U13.43
  Bottom 0.203: 19.8,21.8 19.85,21.75 R35.1
  Bottom 0.254: v19.6,28.5 18.8,27.7 18.8,22.8 19.8,21.8
I2C2_SCL  (via drill 0.25)
  Top 0.254: v70.2,26.1 70.8,26.1 U14.3
  Bottom 0.203: 49.3,28.8 49,28.5 R36.1 48.5,28.5
  Bottom 0.254: v70.2,26.1 62.4,26.1 60.6,27.9 53,27.9 51.3,29.6 50.1,29.6 49.3,28.8 | 47.5,28.5 R38.2 48.5,28.5
I2C2_SCLI  (via drill 0.25)
  Top 0.203: U13.21 v28.6,30
  Bottom 0.203: R38.1 45.6,28.5
  Bottom 0.254: v28.6,30 41.1,30 41.6,29.5 44.6,29.5 45.6,28.5
I2C2_SDA  (via drill 0.25)
  Top 0.254: v60.7,28.5 68.1,21.1 70.5,21.1 70.8,21.4 U14.4
  Bottom 0.203: 49.2,31.2 49,31.4 R37.1 48.85,31.3 48.6,31.3 | 48,30.7 47.9,30.6 R39.2
  Bottom 0.254: 48,30.7 48.6,31.3 | v60.7,28.5 53.3,28.5 51.5,30.3 50.1,30.3 49.2,31.2
I2C2_SDAI  (via drill 0.25)
  Top 0.203: U13.22 29,30.5 v29.1,30.6
  Bottom 0.203: R39.1 45.85,30.5 45.7,30.5
  Bottom 0.254: v29.1,30.6 41.4,30.6 41.9,30.1 45.3,30.1 45.7,30.5
IN
  Top 0.203: U1.8 60.12,40.48 60.25,40.35 R1.1
  Top 0.406: 60.48,40.27 R1.1 60.45,40.25 Q1.2
N$1
  Bottom 0.203: C7.2 54.85,31.3 55,31.3 | R27.2 56,31.25 56,31.3
  Bottom 0.254: 54.6,31.3 55,31.3 56,31.3 56.2,31.3
N$2
  Top 0.203: R50.1 19.45,42.4
  Top 0.254: 19.45,42.4 U15.3
N$3
  Top 0.406: C6.2 R26.2
N$4
  Top 0.203: R49.1 17.55,42.4
  Top 0.254: 17.55,42.4 U15.1
N$5
  Top 0.203: L1.1 46.35,39.8 46.8,39.8 | U5.5 46.75,37.1 46.8,37.1
  Top 0.406: 46.8,37.1 46.8,39.8
N$6
  cutout Top: 38.1,10.6 38.1,21 36.1,23 36.1,23 38.1,21
  cutout GND: 38.1,10.6 38.1,21 36.1,23 36.1,23 38.1,21
  cutout Bottom: 38.1,10.6 38.1,21 36.1,23 36.1,23 38.1,21
N$7
  Top 0.203: 14.3,14 R212.1
  Top 0.254: J6.27 37.5,3.5 35.7,1.7 21.9,1.7 14.3,9.3 14.3,14
N$9
  Top 0.203: 16.3,14 R211.1
  Top 0.254: J6.19 33.5,3.3 32.8,2.6 23.5,2.6 16.3,9.8 16.3,14
N$15
  Top 0.203: U1.7 59.17,40.02 60.4,38.8 60.4,38.65 R1.2
  Top 0.406: Q2.3 R1.2
N$25  (via drill 0.25)
  Top 0.203: LED2.2 12.35,54.15
  Top 0.254: v12.25,52.75 LED2.2
  Bottom 0.254: R23.1 12.35,52.65 v12.25,52.75
N$27  (via drill 0.25)
  Top 0.203: 31.3,39.3 31.46,39.14 J1.1
  Top 0.254: v31.3,39.8 31.3,39.3
  Bottom 0.203: R46.2 30.65,40.3 30.8,40.3
  Bottom 0.254: v31.3,39.8 30.8,40.3
N$29  (via drill 0.25)
  Top 0.203: LED1.2 6.1,54.1
  Top 0.254: v6.25,52.75 LED1.2
  Bottom 0.254: v6.25,52.75 6.15,52.65 R22.1
N$35  (via drill 0.25)
  Top 0.203: 39,39 39.16,38.84 J1.8
  Top 0.254: v39,39.8 39,39
  Bottom 0.203: 39,40.5 39.25,40.75 R47.2
  Bottom 0.254: 39,40.5 v39,39.8
NRST
  Top 0.203: U13.7 23.5,24.8 22.7,25.6 20.7,25.6 18.9,23.8 13.3,23.8 11.6,22.1 11.5,22.1 C16.1 11.1,22.25 11.1,22.1 | 4.8,20 SW3.2
  Top 0.254: 11.1,22.1 9,20 4.8,20
NTC  (via drill 0.25)
  Top 0.203: v58,36.5 57,36.5 U2.8
  Bottom 0.203: 58.7,36.5 59,36.2 R8.1
  Bottom 0.254: 58.9,35.9 R8.1 R9.1 | v58,36.5 58.7,36.5
OSC_IN
  Top 0.203: U13.5 22.5,23.4 21.4,22.3 21.4,20.4 22.1,19.7 | 22.1,19.7 22.1,18.15 22.05,17.85 C3.2 | 22.1,19.7 22.1,19.95 X1.3 22.1,19.7
OSC_OUT
  Top 0.203: U13.6 23,22.8 23.1,22.7 23.1,22 23.8,21.3 X1.1 24.15,21.4 24.5,21.1 25.5,20.1 25.5,19.45 C2.2
PA8  (via drill 0.25)
  Top 0.203: U13.29 24,35 v25.1,36.1 25.1,37 24,38.1 TP13.1
  Bottom 0.203: R12.1 35,36.35 35,36.1
  Bottom 0.254: v25.1,36.1 35,36.1 35.3,36.1
PA8-EN  (via drill 0.25)
  Top 0.203: 43.9,33.4 43.79,33.29 U6.4 | 48.6,30.45 48.6,30.35 U4.3
  Top 0.254: 48.6,30.45 48.6,31.4 46.9,33.1 v46.9,33.7 | 43.9,33.4 v44.2,33.7 | v37.7,33.7 v37.7,36.1
  Bottom 0.203: R41.2 39,36.25 39,36.1 | R12.2 37.1,36.25 37.1,36.1 | R14.1 40.5,36.25 40.5,36.1
  Bottom 0.254: 40.8,36.1 40.5,36.1 39,36.1 v37.7,36.1 37.1,36.1 | v46.9,33.7 v44.2,33.7 v37.7,33.7
PA9  (via drill 0.25)
  Top 0.203: v23.5,32.4 U13.30
  Top 0.61: J6.23 v35.5,3.5
  Bottom 0.254: v35.5,3.5 33.7,5.3 26.3,5.3 25.4,4.4 21.6,4.4 17.4,8.6 17.4,28.3 20.3,31.2 22.4,31.2 23.5,32.3 v23.5,32.4
PA10  (via drill 0.25)
  Top 0.203: v22.7,32.4 23,32.7 U13.31
  Top 0.61: J6.21 v34.5,3.5
  Bottom 0.254: v34.5,3.5 33.3,4.7 26.8,4.7 25,2.9 21.9,2.9 16.7,8.1 16.7,28.6 19.9,31.8 22.1,31.8 v22.7,32.4
PA15
  Top 0.203: LED1.1 2.75,52.75 4,51.5 5.7,51.5 10.2,47 10.2,37.4 16.6,31 U13.38
  Top 0.254: LED1.1 2.85,54.25
PB2
  Top 0.203: U13.20 27.2,29.5 25,31.7 20.2,31.7 19.3,32.6 16.5,32.6 12.3,36.8 12.3,43.1 R29.1 12.4,43.1 12.4,43
  Top 0.254: 12.4,43 12.4,49.1 8.75,52.75 LED2.1
PB4  (via drill 0.25)
  Top 0.203: U13.40 22,30 v22.6,29.4
  Top 0.254: v71.3,21.2 U14.5
  Bottom 0.203: R40.1 42.15,28.1 42.1,28.1
  Bottom 0.254: v71.3,21.2 66.3,21.2 60.2,27.3 42.9,27.3 42.1,28.1 40.8,29.4 v22.6,29.4
PB5  (via drill 0.25)
  Top 0.203: U13.41 v19.6,29.5
  Top 0.61: J6.25 v36.5,3.5
  Bottom 0.254: v19.6,29.5 18.1,28 18.1,9 22,5.1 24.4,5.1 25.2,5.9 34.1,5.9 v36.5,3.5
PB8  (via drill 0.25)
  Top 0.203: U13.45 20.7,27.5 v21.7,28.5
  Top 0.254: v55.5,33.1 U2.4
  Bottom 0.203: R42.2 32.5,34.15 32.5,34.3
  Bottom 0.254: v55.5,33.1 54.3,34.3 32.5,34.3 31.8,34.3 27.5,30 22.2,30 21.7,29.5 v21.7,28.5
PB9  (via drill 0.25)
  Top 0.203: U13.46 21,27 23.3,29.3 v23.3,31.2 | U2.11 v55.5,38.8
  Bottom 0.203: R48.1 25.4,33.45 25.55,33.45
  Bottom 0.254: v23.3,31.2 25.55,33.45 27.6,35.5 49,35.5 52.3,38.8 v55.5,38.8
PC13  (via drill 0.25)
  Top 0.203: U13.2 21,25 v21.1,25.1
  Top 0.254: v56,32.6 U2.5
  Bottom 0.203: R43.2 28.5,34.65 28.5,34.9
  Bottom 0.254: v21.1,25.1 21.1,29.8 21.9,30.6 23.6,30.6 27.9,34.9 28.5,34.9 54.7,34.9 56,33.6 v56,32.6
PC14  (via drill 0.25)
  Top 0.61: J6.17 v32.5,3.5
  Bottom 0.254: R24.1 15,16.7 16,15.7 16,7.7 21.4,2.3 25.5,2.3 27.3,4.1 31.9,4.1 v32.5,3.5
PC14-S  (via drill 0.25)
  Top 0.203: U13.3 21.5,23.7 20.5,22.7 19.5,22.7 19.15,22.35 X2.2 | 17.2,22.3 17.15,22.35 C4.2
  Top 0.254: 17.2,22.3 X2.2 19.2,22.3 | C4.2 15.95,21.3 v15.4,21.3
  Bottom 0.203: 15.4,19 15,18.6 R24.2
  Bottom 0.254: v15.4,21.3 15.4,19
PC15  (via drill 0.25)
  Top 0.203: R212.2 14.5,15.85 14.5,15.7 | R211.2 16.1,15.85 16.1,15.7
  Top 0.254: 16.1,15.7 14.5,15.7 v13,15.7
  Bottom 0.254: R25.2 v13,15.7
PC15-S  (via drill 0.25)
  Top 0.203: U13.4 22,23.6 20.5,22.1 20.5,20.9 19.4,19.8 X2.1 18.8,19.8 18.6,20 | 17.3,20 17.3,20.1 C5.2 16.65,20.1 16.65,19.8
  Top 0.254: 18.6,20 17.3,20 | 16.65,19.8 v13.4,19.8
  Bottom 0.203: 13.4,18.7 13.15,18.45 R25.1
  Bottom 0.254: v13.4,19.8 13.4,18.7
PROG
  Top 0.203: U2.12 55,37.8 54.1,38.7 54.1,38.9 R6.2
SPI1_MISO  (via drill 0.25)
  Top 0.203: v26.2,27.3 26.4,27.5 U13.16
  Top 0.61: J6.22 v34.5,10.5
  Bottom 0.254: v26.2,27.3 26.2,9.9 27.4,8.7 32.7,8.7 v34.5,10.5
SPI1_MOSI  (via drill 0.25)
  Top 0.203: v26.9,28 U13.17
  Top 0.61: J6.20 v33.5,10.5
  Bottom 0.254: v33.5,10.5 32.3,9.3 27.7,9.3 26.9,10.1 v26.9,28
SPI1_NSS  (via drill 0.25)
  Top 0.203: v25.5,27.3 26.3,26.5 U13.14
  Top 0.61: J6.24 v35.5,10.5
  Bottom 0.203: 24.8,18.5 24.75,18.45 R30.1
  Bottom 0.254: 25.5,18.5 25.5,9.7 27.1,8.1 33.1,8.1 v35.5,10.5 | 25.5,18.5 v25.5,27.3 | 24.8,18.5 25.5,18.5
SPI1_SCK  (via drill 0.25)
  Top 0.203: U13.15 v28.6,27
  Top 0.61: J6.18 v32.5,10.5
  Bottom 0.254: v32.5,10.5 31.9,9.9 28.1,9.9 27.6,10.4 27.6,26 v28.6,27
SPI2_MISO
  Top 0.203: U13.27 25,34.3 28.5,37.8 37.5,37.8 38.06,38.36 J1.7
SPI2_MOSI
  Top 0.203: U13.28 24.5,34.6 28.8,38.9 28.8,39.4 29.8,40.4 32.6,40.4 33.75,39.25 33.66,39.16 J1.3
SPI2_NSS  (via drill 0.25)
  Top 0.203: U13.25 26,33.7 v29,36.7 | 32.5,38.9 32.56,38.84 J1.2
  Top 0.254: v32.5,39.8 32.5,38.9
  Bottom 0.203: R31.1 29.9,37.95 29.9,37.6
  Bottom 0.254: v29,36.7 29.9,37.6 32.1,39.8 v32.5,39.8
SPI2_SCK  (via drill 0.25)
  Top 0.203: U13.26 25.5,34 28.8,37.3 v31.4,37.3 | 35.8,39 35.86,38.94 J1.5
  Top 0.254: v35.8,39.8 35.8,39
  Bottom 0.254: v31.4,37.3 33.3,39.2 35.2,39.2 v35.8,39.8
SWCLK  (via drill 0.25)
  Top 0.203: v17.6,31.5 U13.37 | 3.86,29.75 3.86,29.73 J3.4
  Top 0.254: v2,29.75 3.86,29.75
  Bottom 0.254: v17.6,31.5 13.05,26.95 4.8,26.95 v2,29.75
SWDIO  (via drill 0.25)
  Top 0.203: v2,28.5 2.04,28.46 | v21.6,32.4 21.5,32.5 U13.34
  Top 0.254: 2.04,28.46 J3.2
  Bottom 0.254: v21.6,32.4 19.5,32.4 13.4,26.3 4.2,26.3 v2,28.5
TIMER
  Top 0.203: C1.1 57.7,31.75 57.7,31.9
  Top 0.254: U2.6 56.5,33.1 57.7,31.9
TRACESWO  (via drill 0.25)
  Top 0.203: v15.6,30.5 U13.39 | J3.6 4.6,31
  Top 0.254: 4.6,31 v5.5,31
  Bottom 0.254: v5.5,31 15.1,31 v15.6,30.5
USBD+
  Top 0.406: J2.3 19,49.75 19.45,49.3 U15.4
USBD-
  Top 0.406: J2.2 18.35,49.85 17.55,49.05 U15.6
USBDM
  Top 0.203: U13.32 22.5,34.4 20.6,36.3 17.8,39 17.8,40.5 17.65,40.65 R49.2
USBDP  (via drill 0.23)
  Top 0.203: U13.33 22,34.1 v19.9,36.2 | 19.9,40.2 19.5,40.6 R50.2
  Top 0.254: v19.9,39.05 19.9,40.2 | R50.2 R51.1
  Bottom 0.254: v19.9,36.2 v19.9,39.05
VBAT  (via drill 0.3, 0.6)
  Top 0.203: 71.7,27.9 71.7,27.5 C15.1 72,27.5
  Top 0.254: U2.14 54,37.4 v53.8,37.6 | U14.1 71.8,27.4 C15.1
  Top 0.61: v69,31.5 71.7,28.8 71.7,27.9 | v69,31.5 TP3.1 | v69,31.5 Q4.3
  pour SUPPLY: 53.6,37.8 54,37.8 57.8,34 70.5,34 70.5,31.1 67.9,31.1 66,33 57.5,33 53.6,36.9
VBAT_I  (via drill 0.25)
  Top 0.254: v71.8,22 U14.6
  Bottom 0.203: 76.6,19.2 76.8,19 J4.1
  Bottom 0.61: v71.8,22 74.6,19.2 76.6,19.2
VBUS  (via drill 0.3, 0.6)
  Top 0.203: 53.9,33.8 53.9,33.85 U2.1
  Top 0.254: v53.4,33.3 53.9,33.8
  Top 0.406: J2.1 17.7,50.7 v16.5,49.5 | U15.5 v18.5,48.5 | v52.7,38.2 52.7,34 v53.4,33.3
  Top 0.813: v16.5,49.5 15.3,48.3
  Bottom 0.203: 53.4,31.7 53.05,31.35 C7.1
  Bottom 0.254: v53.4,33.3 53.4,31.7
  pour SUPPLY: 13.3,50 47,50 53,44 53,38.1 52.2,38.1 46.5,43.8 44.8,43.8 43.1,45.5 13.3,45.5
VNTC  (via drill 0.25)
  Top 0.203: U2.9 56.5,37.1 57,37.6 v58,37.6
  Bottom 0.203: 58.6,37.6 58.9,37.9 R8.2
  Bottom 0.254: v58,37.6 58.6,37.6
VSUP  (via drill 0.6)
  Top 0.203: 23.8,13.5 23.8,14.1 TP4.1 | 43.15,34 U6.1
  Top 0.61: 23.8,13.5 25.5,11.8 J6.4 J6.3
  Top 0.813: v43.15,38.3 43.15,34
  pour SUPPLY: 43.7,37.9 43.7,38.8 24.8,38.8 17,31 17,18.5 21.2,14.3 21.2,13.2 22.2,12.2 24.1,12.2 25.1,13.2 25.1,14.5 23,14.5 18.5,19 18.5,30.8 23.2,35.5 24,35.5 26.4,37.9
VSUP_I  (via drill 0.25)
  Top 0.203: 38.2,29.6 38.15,29.55 U8.4 | 40.15,29.35 39.5,29.35 R16.2 39.3,29.55 39.3,29.6 | 41,34.1 41.1,34.2 C9.1 41.05,34.4 40.9,34.4 | 39.7,34.4 39.65,34.35 U3.1 | 48.1,28.5 48.85,28.5 U4.1 49.2,28.45 49.2,28.5 | 50.25,28.5 50.3,28.55 C13.1 | C11.1 45.25,34.9 45.4,34.9 45.6,34.7 45.7,34.7 | U5.1 46.75,34.85 46.8,34.9 46.45,34.9 | 41,31.9 41.2,32.1 42.7,32.1 | 45.7,31.9 45.8,31.9 | U6.3 43.05,32.45
  Top 0.254: 43.5,32.2 43.2,32.5 43.1,32.5 43.05,32.45 42.7,32.1 | v47.4,36.7 47.4,36.2 46.8,35.6 46.8,34.9
  Top 0.406: 46.45,34.9 45.4,34.9 | 38.2,29.6 39.3,29.6 | 40.9,34.4 39.7,34.4 | 50.25,28.5 49.2,28.5
  Top 0.813: 40.15,29.35 41,30.2 41,31.9 | 41,31.9 41,34.1 | 48.1,28.5 47.7,28.9 47.7,31 46.8,31.9 45.8,31.9 | 41,31.9 45.7,31.9 45.7,34.7
  Bottom 0.203: 47.4,37.8 47.4,37.95 R10.1
  Bottom 0.254: v47.4,36.7 47.4,37.8
VSUP_I_SENSE
  Top 0.203: U13.18 29.7,28.5 30.6,29.4 35.1,29.4 U8.3
VSUP_R  (via drill 0.6)
  Top 0.203: R151.2 33.05,32.1 33.3,32.1 | 38.3,31.4 37.8,31.4 U8.5 37.3,31.45 37.3,31.5 | 39.5,31.6 39.4,31.5 R16.1 39.4,31.3 39.3,31.4 | R4.2 63,30.6 | Q4.2 65.15,30.55 65.1,30.5 65,30.6 | 61.4,30.6 61.45,30.65 Q3.2 61.45,30.75 61.3,30.6 | 53.4,29.2 53.45,29.25 C8.1 54.05,29.2 54.05,29.05 | 53,32.3 52.9,32.2 52.7,32.2 | 65.1,29 TP12.1
  Top 0.254: 53,32.3 53.9,32.3 54.5,32.9 U2.2 | 37.3,31.5 36.7,32.1 33.3,32.1
  Top 0.406: 53.8,29.3 54.05,29.05 54.9,28.2 58.9,28.2 61.3,30.6 | 65,30.6 63,30.6 61.4,30.6 | 38.3,31.4 39.3,31.4 | 65.1,30.5 65.1,29
  Top 0.813: 39.5,31.6 v39.5,32.5 | 53.4,29.2 52.8,29.8 52.8,32.1 52.7,32.2 v52,32.9
  SUPPLY 1: v39.5,32.5 39.8,32.8 51.9,32.8 v52,32.9
VSUP_V_SENSE
  Top 0.203: U13.19 29,29 30.5,30.5 30.65,30.5 R152.2 30.85,30.6 31.3,30.6 | R151.1 32.75,30.6 32.35,30.6
  Top 0.254: 32.35,30.6 31.3,30.6
WALL
  Top 0.203: 50.5,44 J5.1 | 59.3,44 59.3,44.05 Q1.3
  Top 0.61: 57.5,44 TP10.1
  Top 0.813: 50.5,44 57.5,44 59.3,44
WALL_P  (via drill 0.25)
  Top 0.203: 60.6,33.6 60.5,33.5 Q3.3 | 57,33.8 57.1,33.7 57.1,33.6 | 61.5,34.6 61.45,34.65 Q2.2 61.7,35.2 61.6,35.3 | 63.4,35.2 63.4,35.05 C6.1
  Top 0.254: U1.3 55.98,39.58 v55.8,39.4 | 57,33.83 U2.7 57,33.8 | 61.6,35.3 v61.6,39.4
  Top 0.406: 57.1,33.6 60.6,33.6 61.5,34.6 | 61.7,35.2 63.4,35.2
  Bottom 0.254: v61.6,39.4 v55.8,39.4

## Text on the board
tPlace: OFF | ON | DGND | WALL | VBUS | SW2 | D3V3_STM | MCO | VBAT | SWD | VSUP_R | F | D3V3 | A3V3 | RESET | BOOT0 | DGND | VSUP | D1V5 | A1V5 | AGND | S | 1 | 83
bPlace: DC +5V | PWR SW | Rev | BAT | Power management module | for the Marmote platform | Vanderbilt University, ISIS | Copyright c 2013 | http://marmote.googlecode.com